# EAGLE design OGX360I-4CH - Main (EAGLE 9.6.2)
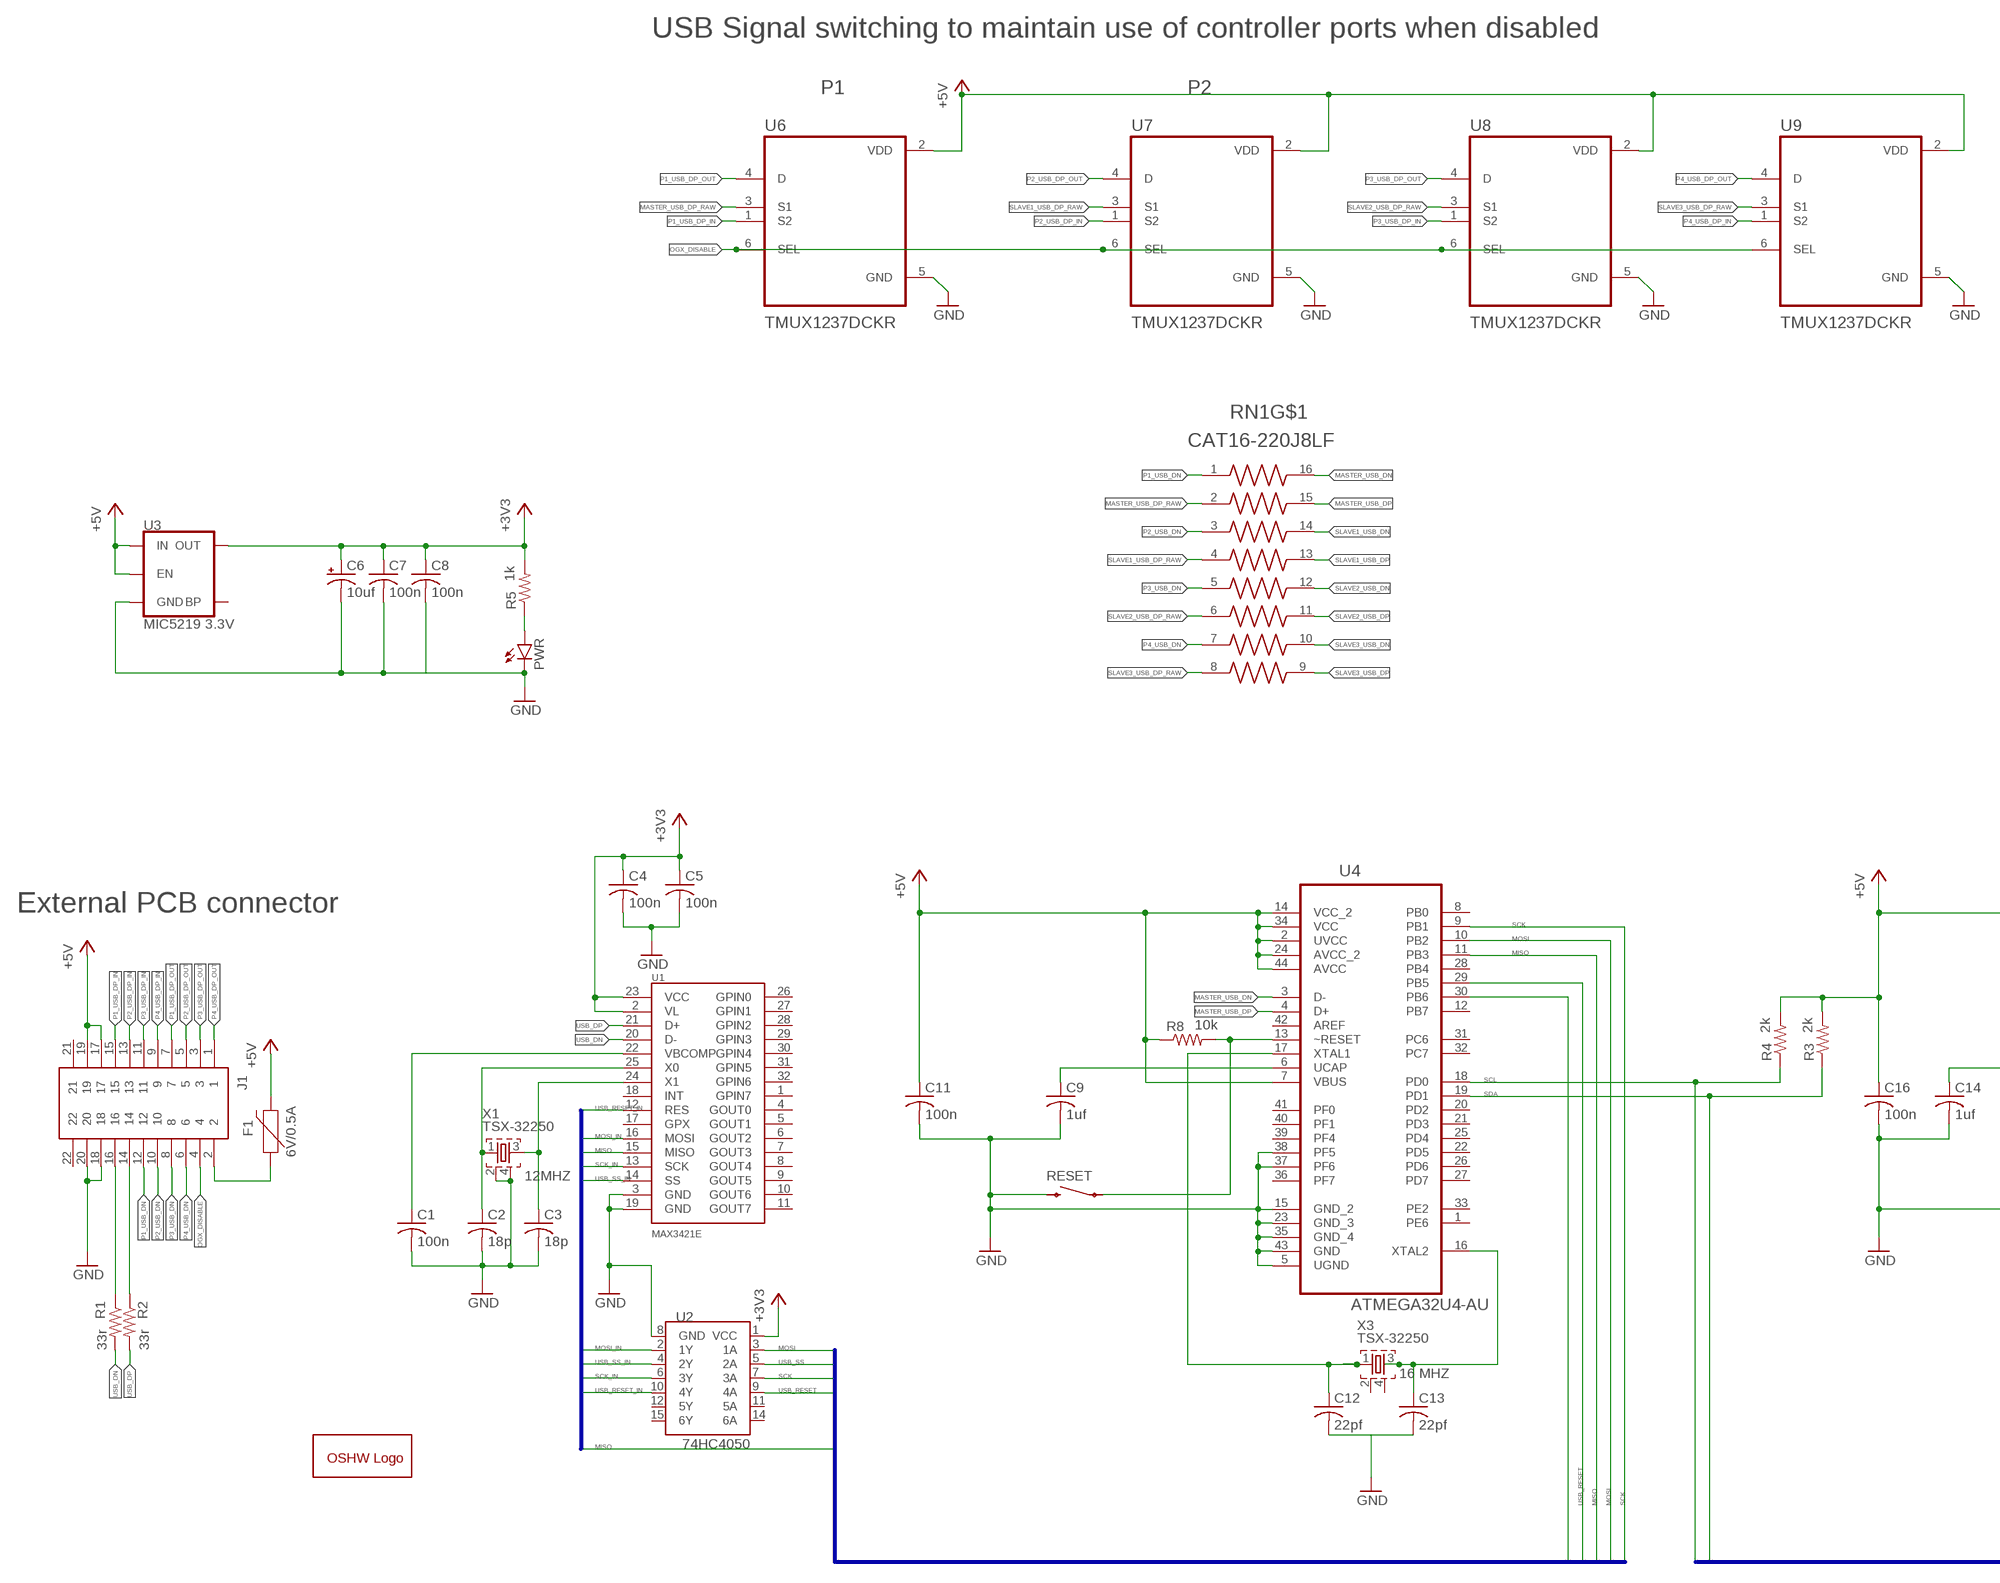
[diagram p0: schematic, sheet 1, part 1 of 2]
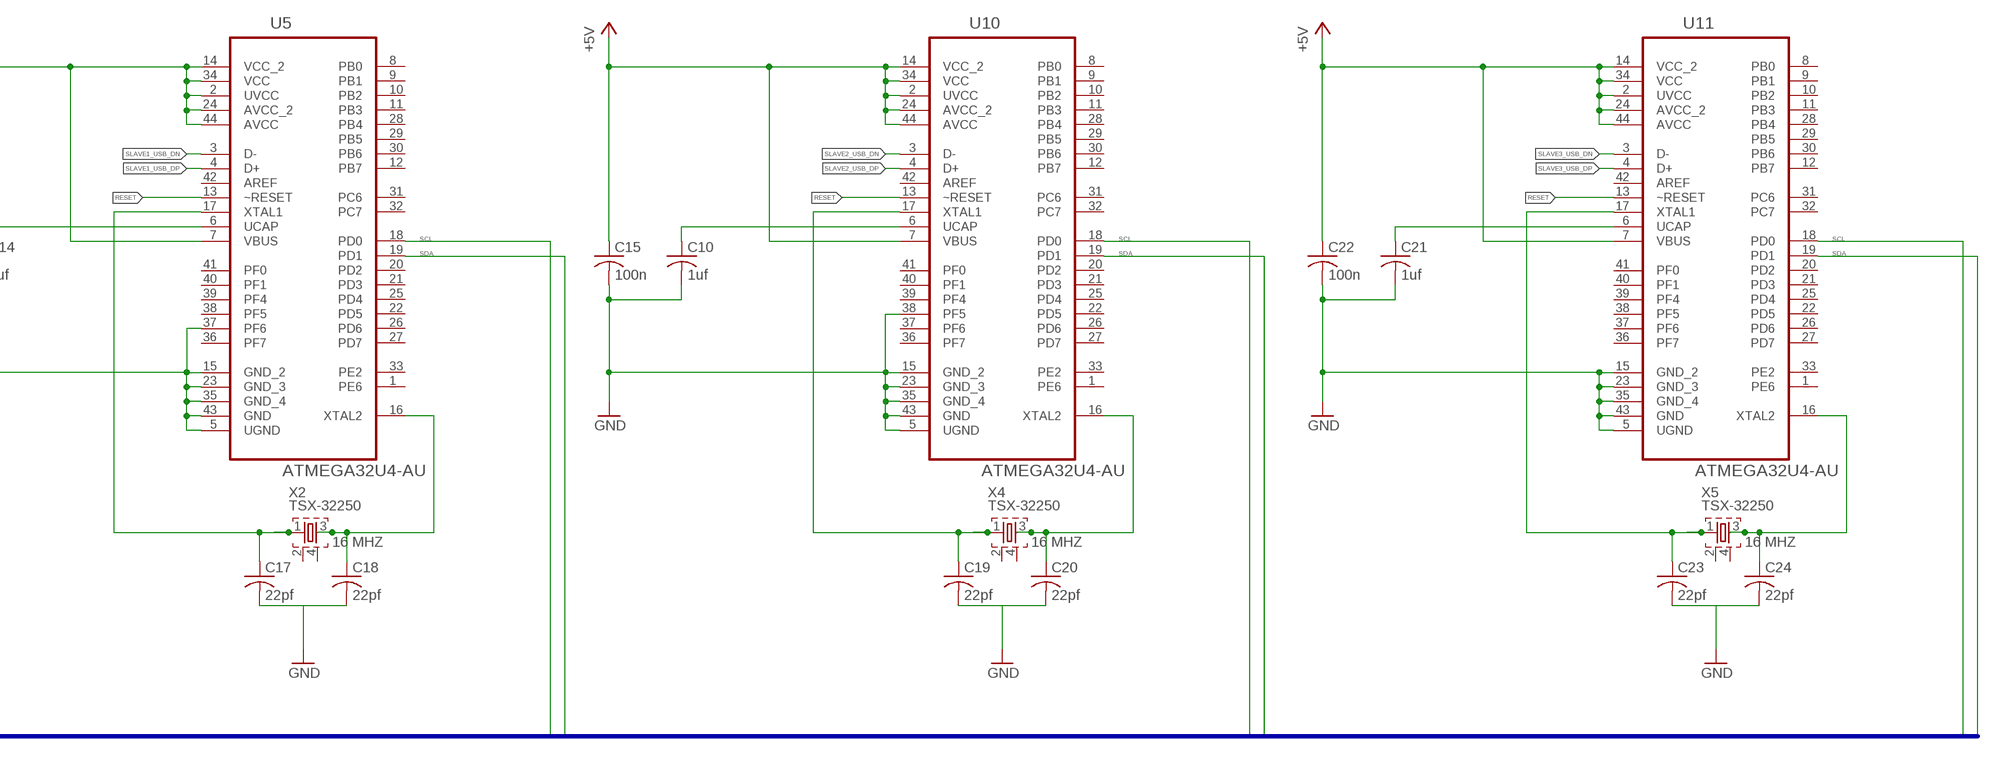
[diagram p1: schematic, sheet 1, part 2 of 2]

## Parts
C1  100n  C-USC0805  [C0805]
C2  18p  C-USC0805  [C0805]
C3  18p  C-USC0805  [C0805]
C4  100n  C-USC0805  [C0805]
C5  100n  C-USC0805  [C0805]
C6  10uf  CPOL-US153CLV-0405  [153CLV-0405]
C7  100n  C-USC0805  [C0805]
C8  100n  C-USC0805  [C0805]
C9  1uf  C-USC0805  [C0805]
C10  1uf  C-USC0805  [C0805]
C11  100n  C-USC0805  [C0805]
C12  22pf  C-USC0805  [C0805]
C13  22pf  C-USC0805  [C0805]
C14  1uf  C-USC0805  [C0805]
C15  100n  C-USC0805  [C0805]
C16  100n  C-USC0805  [C0805]
C17  22pf  C-USC0805  [C0805]
C18  22pf  C-USC0805  [C0805]
C19  22pf  C-USC0805  [C0805]
C20  22pf  C-USC0805  [C0805]
C21  1uf  C-USC0805  [C0805]
C22  100n  C-USC0805  [C0805]
C23  22pf  C-USC0805  [C0805]
C24  22pf  C-USC0805  [C0805]
F1  6V/0.5A  PPTC_HALF-AMP  [1206]
GOLD_ORB_SM1  OSHWLOGOLOGO8MM  [OSHW_8MM]
J1  SM20B-SRDS-G-TF(LF)(SN)  [SM20BSRDSGTFLFSN]
PWR  LEDCHIP-LED0805  [CHIP-LED0805]
R1  33r  R-US_M0805  [M0805]
R2  33r  R-US_M0805  [M0805]
R3  2k  R-US_M0805  [M0805]
R4  2k  R-US_M0805  [M0805]
R5  1k  R-US_M0805  [M0805]
R8  10k  R-US_M0805  [M0805]
RESET  TL3305AF160QG  [TL3305AF160QG]
RN1  CAT16-220J8LF  CAT16-330J8LF  [RESCAV80P640X160X75-16N]
U1  MAX3421E  [TQFP32-5MM]
U2  74HC4050  HEX_CONVERTER  [SO16]
U3  MIC5219 3.3V  V_REG_MIC52193.3V  [SOT23-5]
U4  ATMEGA32U4-AU  [QFP80P1200X1200X120-44N]
U5  ATMEGA32U4-AU  [QFP80P1200X1200X120-44N]
U6  TMUX1237DCKR  [SOT65P210X110-6N]
U7  TMUX1237DCKR  [SOT65P210X110-6N]
U8  TMUX1237DCKR  [SOT65P210X110-6N]
U9  TMUX1237DCKR  [SOT65P210X110-6N]
U10  ATMEGA32U4-AU  [QFP80P1200X1200X120-44N]
U11  ATMEGA32U4-AU  [QFP80P1200X1200X120-44N]
X1  TSX-32250  [TSX-3225]
X2  TSX-32250  [TSX-3225]
X3  TSX-32250  [TSX-3225]
X4  TSX-32250  [TSX-3225]
X5  TSX-32250  [TSX-3225]

## Nets
+3V3: C4.1 C5.1 C6.+ C7.1 C8.1 R5.2 U1.2(VL) U1.23(VCC) U2.1(VCC) U3.5(OUT)
+5V: C11.1 C15.1 C16.1 C22.1 F1.2 J1.17 J1.19 R3.2 R4.2 R8.1 U3.1(IN) U3.3(EN) U4.2(UVCC) U4.7(VBUS) U4.14(VCC_2) U4.24(AVCC_2) U4.34(VCC) U4.44(AVCC) U5.2(UVCC) U5.7(VBUS) U5.14(VCC_2) U5.24(AVCC_2) U5.34(VCC) U5.44(AVCC) U6.2(VDD) U7.2(VDD) U8.2(VDD) U9.2(VDD) U10.2(UVCC) U10.7(VBUS) U10.14(VCC_2) U10.24(AVCC_2) U10.34(VCC) U10.44(AVCC) U11.2(UVCC) U11.7(VBUS) U11.14(VCC_2) U11.24(AVCC_2) U11.34(VCC) U11.44(AVCC)
EXT_USB_DN: J1.16 R1.1
EXT_USB_DP: J1.14 R2.1
FUSED_+5V: F1.1 J1.2
GND: C1.2 C2.2 C3.2 C4.2 C5.2 C6.- C7.2 C8.2 C9.2 C10.2 C11.2 C12.2 C13.2 C14.2 C15.2 C16.2 C17.2 C18.2 C19.2 C20.2 C21.2 C22.2 C23.2 C24.2 J1.18 J1.20 PWR.C RESET.P$1 RESET.P$2 U1.3(GND) U1.19(GND) U2.8(GND) U3.2(GND) U4.5(UGND) U4.15(GND_2) U4.23(GND_3) U4.35(GND_4) U4.37(PF6) U4.38(PF5) U4.43(GND) U5.5(UGND) U5.15(GND_2) U5.23(GND_3) U5.35(GND_4) U5.37(PF6) U5.43(GND) U6.5(GND) U7.5(GND) U8.5(GND) U9.5(GND) U10.5(UGND) U10.15(GND_2) U10.23(GND_3) U10.35(GND_4) U10.38(PF5) U10.43(GND) U11.5(UGND) U11.15(GND_2) U11.23(GND_3) U11.35(GND_4) U11.43(GND) X1.2 X1.4
MASTER_USB_DN: RN1.16(R1-2) U4.3(D-)
MASTER_USB_DP: RN1.15(R2-2) U4.4(D+)
MASTER_USB_DP_RAW: RN1.2(R2-1) U6.3(S1)
MISO: U1.15(MISO) U4.11(PB3)
MOSI: U2.3(1A) U4.10(PB2)
MOSI_IN: U1.16(MOSI) U2.2(1Y)
N$1: C13.1 U4.16(XTAL2) X3.3
N$2: C3.1 U1.24(X1) X1.3
N$3: C10.1 U10.6(UCAP)
N$4: PWR.A R5.1
N$5: C2.1 U1.25(X0) X1.1
N$6: C1.1 U1.22(VBCOMP)
N$8: C20.1 U10.16(XTAL2) X4.3
N$9: C19.1 U10.17(XTAL1) X4.1
N$10: C9.1 U4.6(UCAP)
N$11: C21.1 U11.6(UCAP)
N$12: C24.1 U11.16(XTAL2) X5.3
N$13: C23.1 U11.17(XTAL1) X5.1
N$14: C12.1 U4.17(XTAL1) X3.1
N$15: C14.1 U5.6(UCAP)
N$20: C18.1 U5.16(XTAL2) X2.3
N$21: C17.1 U5.17(XTAL1) X2.1
OGX_DISABLE: J1.4 U6.6(SEL) U7.6(SEL) U8.6(SEL) U9.6(SEL)
P1_USB_DN: J1.12 RN1.1(R1-1)
P1_USB_DP_IN: J1.15 U6.1(S2)
P1_USB_DP_OUT: J1.7 U6.4(D)
P2_USB_DN: J1.10 RN1.3(R3-1)
P2_USB_DP_IN: J1.13 U7.1(S2)
P2_USB_DP_OUT: J1.5 U7.4(D)
P3_USB_DN: J1.8 RN1.5(R5-1)
P3_USB_DP_IN: J1.11 U8.1(S2)
P3_USB_DP_OUT: J1.3 U8.4(D)
P4_USB_DN: J1.6 RN1.7(R7-1)
P4_USB_DP_IN: J1.9 U9.1(S2)
P4_USB_DP_OUT: J1.1 U9.4(D)
RESET: R8.2 RESET.P$3 RESET.P$4 U4.13(~RESET) U5.13(~RESET) U10.13(~RESET) U11.13(~RESET)
SCK: U2.7(3A) U4.9(PB1)
SCK_IN: U1.13(SCK) U2.6(3Y)
SCL: R4.1 U4.18(PD0) U5.18(PD0) U10.18(PD0) U11.18(PD0)
SDA: R3.1 U4.19(PD1) U5.19(PD1) U10.19(PD1) U11.19(PD1)
SLAVE1_USB_DN: RN1.14(R3-2) U5.3(D-)
SLAVE1_USB_DP: RN1.13(R4-2) U5.4(D+)
SLAVE1_USB_DP_RAW: RN1.4(R4-1) U7.3(S1)
SLAVE2_USB_DN: RN1.12(R5-2) U10.3(D-)
SLAVE2_USB_DP: RN1.11(R6-2) U10.4(D+)
SLAVE2_USB_DP_RAW: RN1.6(R6-1) U8.3(S1)
SLAVE3_USB_DN: RN1.10(R7-2) U11.3(D-)
SLAVE3_USB_DP: RN1.9(R8-2) U11.4(D+)
SLAVE3_USB_DP_RAW: RN1.8(R8-1) U9.3(S1)
USB_DN: R1.2 U1.20(D-)
USB_DP: R2.2 U1.21(D+)
USB_RESET: U2.9(4A) U4.29(PB5)
USB_RESET_IN: U1.12(RES) U2.10(4Y)
USB_SS: U2.5(2A) U4.30(PB6)
USB_SS_IN: U1.14(SS) U2.4(2Y)
Unconnected: J1.21 J1.22 U1.1(GPIN7) U1.4(GOUT0) U1.5(GOUT1) U1.6(GOUT2) U1.7(GOUT3) U1.8(GOUT4) U1.9(GOUT5) U1.10(GOUT6) U1.11(GOUT7) U1.17(GPX) U1.18(INT) U1.26(GPIN0) U1.27(GPIN1) U1.28(GPIN2) U1.29(GPIN3) U1.30(GPIN4) U1.31(GPIN5) U1.32(GPIN6) U2.11(5A) U2.12(5Y) U2.14(6A) U2.15(6Y) U3.4(BP) U4.1(PE6) U4.8(PB0) U4.12(PB7) U4.20(PD2) U4.21(PD3) U4.22(PD5) U4.25(PD4) U4.26(PD6) U4.27(PD7) U4.28(PB4) U4.31(PC6) U4.32(PC7) U4.33(PE2) U4.36(PF7) U4.39(PF4) U4.40(PF1) U4.41(PF0) U4.42(AREF) U5.1(PE6) U5.8(PB0) U5.9(PB1) U5.10(PB2) U5.11(PB3) U5.12(PB7) U5.20(PD2) U5.21(PD3) U5.22(PD5) U5.25(PD4) U5.26(PD6) U5.27(PD7) U5.28(PB4) U5.29(PB5) U5.30(PB6) U5.31(PC6) U5.32(PC7) U5.33(PE2) U5.36(PF7) U5.38(PF5) U5.39(PF4) U5.40(PF1) U5.41(PF0) U5.42(AREF) U10.1(PE6) U10.8(PB0) U10.9(PB1) U10.10(PB2) U10.11(PB3) U10.12(PB7) U10.20(PD2) U10.21(PD3) U10.22(PD5) U10.25(PD4) U10.26(PD6) U10.27(PD7) U10.28(PB4) U10.29(PB5) U10.30(PB6) U10.31(PC6) U10.32(PC7) U10.33(PE2) U10.36(PF7) U10.37(PF6) U10.39(PF4) U10.40(PF1) U10.41(PF0) U10.42(AREF) U11.1(PE6) U11.8(PB0) U11.9(PB1) U11.10(PB2) U11.11(PB3) U11.12(PB7) U11.20(PD2) U11.21(PD3) U11.22(PD5) U11.25(PD4) U11.26(PD6) U11.27(PD7) U11.28(PB4) U11.29(PB5) U11.30(PB6) U11.31(PC6) U11.32(PC7) U11.33(PE2) U11.36(PF7) U11.37(PF6) U11.38(PF5) U11.39(PF4) U11.40(PF1) U11.41(PF0) U11.42(AREF) X2.2 X2.4 X3.2 X3.4 X4.2 X4.4 X5.2 X5.4

## Buses
SPI_BUS_3.3V:MISO,MOSI_IN,SCK_IN,USB_RESET_IN,USB_SS_IN
SPI_BUS_5V:MISO,MOSI,SCK,USB_RESET,USB_SS
I2C:SCL,SDA

## Notes on the sheet
- USB Signal switching to maintain use of controller ports when disabled
- P1 | P2
- External PCB connector
- 12MHZ
- 16 MHZ | 16 MHZ | 16 MHZ | 16 MHZ

## Library data of the parts
C1-C5 C7-C24 = rcl:C-US: CAPACITOR, American symbol; SPICEPREFIX: C
C6 = rcl:CPOL-US: POLARIZED CAPACITOR, American symbol; SPICEPREFIX: C
F1 = SparkFun-Fuses:PPTC: Resettable Fuse PPTC Resettable Fuse. Really a sort of resistor with a polymeric positive temperature coefficient whose resistance increases dramatically with an increase in temperature. When heated by the power passing through the resistance rises causing the current to be limited, protecting the circuit. This is achieved by the transition of the polymer from a crystalline to an amorphous state where the conductive carbon separates breaking the conductive pathways found in the cool crystalline structure. When a PPTC cools back down it resumes conducting letting the circuit turn back on. SparkFun Products: SparkFun RedBoard - Programmed with Arduino <https://www.sparkfun.com/products/12757> Pro Micro - 5V/16MHz <https://www.sparkfun.com/products/12640> Arduino Pro 328 - 5V/16MHz <https://www.sparkfun.com/products/10915> MP3 Trigger <https://www.sparkfun.com/products/13720>; PROD_ID: RES-08585
GOLD_ORB_SM1 = oshw:OSHWLOGO: The OSHW logo for PCB layout
J1 = SM20B-SRDS-G-TFLFSN:SM20B-SRDS-G-TF(LF)(SN): JST SHD, 1mm Pitch, 20 Way, Right Angle PCB Header, Surface Mount Source: Datasheet <http://www.jst-mfg.com/product/pdf/eng/eSHD.pdf>; DESCRIPTION: JST SHD, 1mm Pitch, 20 Way, Right Angle PCB Header, Surface Mount; HEIGHT: 5.5mm; MANUFACTURER_NAME: JST (JAPAN SOLDERLESS TERMINALS); MANUFACTURER_PART_NUMBER: SM20B-SRDS-G-TF(LF)(SN)
PWR = led:LED: LED OSRAM: - CHIPLED LG R971, LG N971, LY N971, LG Q971, LY Q971, LO R971, LY R971 LH N974, LH R974 LS Q976, LO Q976, LY Q976 LO Q996 - Hyper CHIPLED LW Q18S LB Q993, LB Q99A, LB R99A - SideLED LS A670, LO A670, LY A670, LG A670, LP A670 LB A673, LV A673, LT A673, LW A673 LH A674 LY A675 LS A676, LA A676, LO A676, LY A676, LW A676 LS A679, LY A679, LG A679 - Hyper Micro SIDELED® LS Y876, LA Y876, LO Y876, LY Y876 LT Y87S - SmartLED LW L88C, LW L88S LB L89C, LB L89S, LG L890 LS L89K, LO L89K, LY L89K LS L896, LA L896, LO L896, LY L896 - TOPLED LS T670, LO T670, LY T670, LG T670, LP T670 LSG T670, LSP T670, LSY T670, LOP T670, LYG T670 LG T671, LOG T671, LSG T671 LB T673, LV T673, LT T673, LW T673 LH T674 LS T676, LA T676, LO T676, LY T676, LB T676, LH T676, LSB T676, LW T676 LB T67C, LV T67C, LT T67C, LS T67K, LO T67K, LY T67K, LW E67C LS E67B, LA E67B, LO E67B, LY E67B, LB E67C, LV E67C, LT E67C LW T67C LS T679, LY T679, LG T679 LS T770, LO T770, LY T770, LG T770, LP T770 LB T773, LV T773, LT T773, LW T773 LH T774 LS E675, LA E675, LY E675, LS T675 LS T776, LA T776, LO T776, LY T776, LB T776 LHGB T686 LT T68C, LB T68C - Hyper Mini TOPLED® LB M676 - Mini TOPLED Santana® LG M470 LS M47K, LO M47K, LY M47K Source: http://www.osram.convergy.de LUXEON: - LUMILED® LXK2-PW12-R00, LXK2-PW12-S00, LXK2-PW14-U00, LXK2-PW14-V00 LXK2-PM12-R00, LXK2-PM12-S00, LXK2-PM14-U00 LXK2-PE12-Q00, LXK2-PE12-R00, LXK2-PE12-S00, LXK2-PE14-T00, LXK2-PE14-U00 LXK2-PB12-K00, LXK2-PB12-L00, LXK2-PB12-M00, LXK2-PB14-N00, LXK2-PB14-P00, LXK2-PB14-Q00 LXK2-PR12-L00, LXK2-PR12-M00, LXK2-PR14-Q00, LXK2-PR14-R00 LXK2-PD12-Q00, LXK2-PD12-R00, LXK2-PD12-S00 LXK2-PH12-R00, LXK2-PH12-S00 LXK2-PL12-P00, LXK2-PL12-Q00, LXK2-PL12-R00 Source: www.luxeon.com KINGBRIGHT: KA-3528ASYC Source: www.kingbright.com
R1-R5 R8 = rcl:R-US_: RESISTOR, American symbol; SPICEPREFIX: R
RESET = TL3305AF160QG:TL3305AF160QG
RN1 = CAT16-330J8LF:CAT16-330J8LF: 33 Ohm ±5% 62.5mW Power Per Element Isolated Resistor Network/Array ±200ppm/°C 2506, Concave, Long Side Terminals Check prices <https://pricing.snapeda.com/parts/CAT16-330J8LF/Bourns/view-part?ref=eda>; AVAILABILITY: Good; DESCRIPTION: 33 Ohm ±5% 62.5mW Power Per Element Isolated Resistor Network/Array ±200ppm/°C 2506, Concave, Long Side Terminals; MF: Bourns; MP: CAT16-330J8LF; PACKAGE: 2506 Bourns; PRICE: None; PURCHASE-URL: https://pricing.snapeda.com/search/part/CAT16-330J8LF/?ref=eda
U1 = MAX3421E:MAX3421E: USB Peripheral/Host Controller with SPI Interface.; AVAILABILITY: Unavailable; DESCRIPTION: USB Controller USB 2.0 SPI Interface 32-TQFN _5x5_; MF: Maxim Integrated; MP: MAX3421E; PACKAGE: TQFP-32 Maxim Integrated; PRICE: None
U2 = 74HC4050:HEX_CONVERTER: 74HC4050 Hex Buffer 74HC4050 Hex Buffer Level Shifter SMD SO016 SparkFun Products CAN-BUS Shield <https://www.sparkfun.com/products/13262> (DEV-13262) SparkFun MP3 Player Shield <https://www.sparkfun.com/products/12660> (DEV-12660) SparkFun microSD Shield <https://www.sparkfun.com/products/12761> (DEV-12761) SparkFun USB Host Shield <https://www.sparkfun.com/products/9947> (DEV-09947); PROD_ID: IC-09604
U3 = MIC5219-3.3YM5-TR:V_REG_MIC5219: V_REG MIC5219 Standard 3.3V and 5V 500mA LDO voltage regulator in SOT-23 layout. Micrel part MIC5219. BP (by-pass) pin is used to lower output noise with 470pF cap, may be left open.; PROD_ID: VREG-09872
U4 U5 U10 U11 = ATMEGA32U4-AU:ATMEGA32U4-AU: 8-bit Microcontroller with ISP Flash and USB Controller; AVAILABILITY: Unavailable; DESCRIPTION: AVR AVR® ATmega Microcontroller IC 8-Bit 16MHz 32KB _16K x 16_ FLASH 44-TQFP _10x10_; MF: Microchip; MP: ATMEGA32U4-AU; PACKAGE: TQFP-44 Microchip; PRICE: None
U6-U9 = TMUX1237DCKR:TMUX1237DCKR: None Check prices <https://pricing.snapeda.com/search/part/TMUX1237DCKR/?ref=eda>; AVAILABILITY: Warning; DESCRIPTION: 3-? low ron, 5-V, 2:1 (SPDT) general purpose switch with no overshoot when switching inputs 6-SC70 -40 to 125; MF: Texas Instruments; MP: TMUX1237DCKR; PACKAGE: SOT-SC70-6 Texas Instruments; PRICE: None; PURCHASE-URL: https://pricing.snapeda.com/search/part/TMUX1237DCKR/?ref=eda
X1-X5 = TSX-3225:TSX-3225: MHz RANGE CRYSTAL UNIT Source: Epson Toyocom; DESCRIPTION: 26MHz ±10ppm Crystal 9pF 40 Ohms 4-SMD, No Lead; DIGI-KEY_PART_NUMBER: SER4180CT-ND; DIGI-KEY_PURCHASE_URL: https://www.digikey.com/product-detail/en/epson/TSX-3225-24.0000MF15X-AC6/SER4180CT-ND/6558821?utm_source=snapeda&utm_medium=aggregator&utm_campaign=symbol; MF: EPSON; MP: TSX-3225; PACKAGE: SMD-4 Epson

## Board
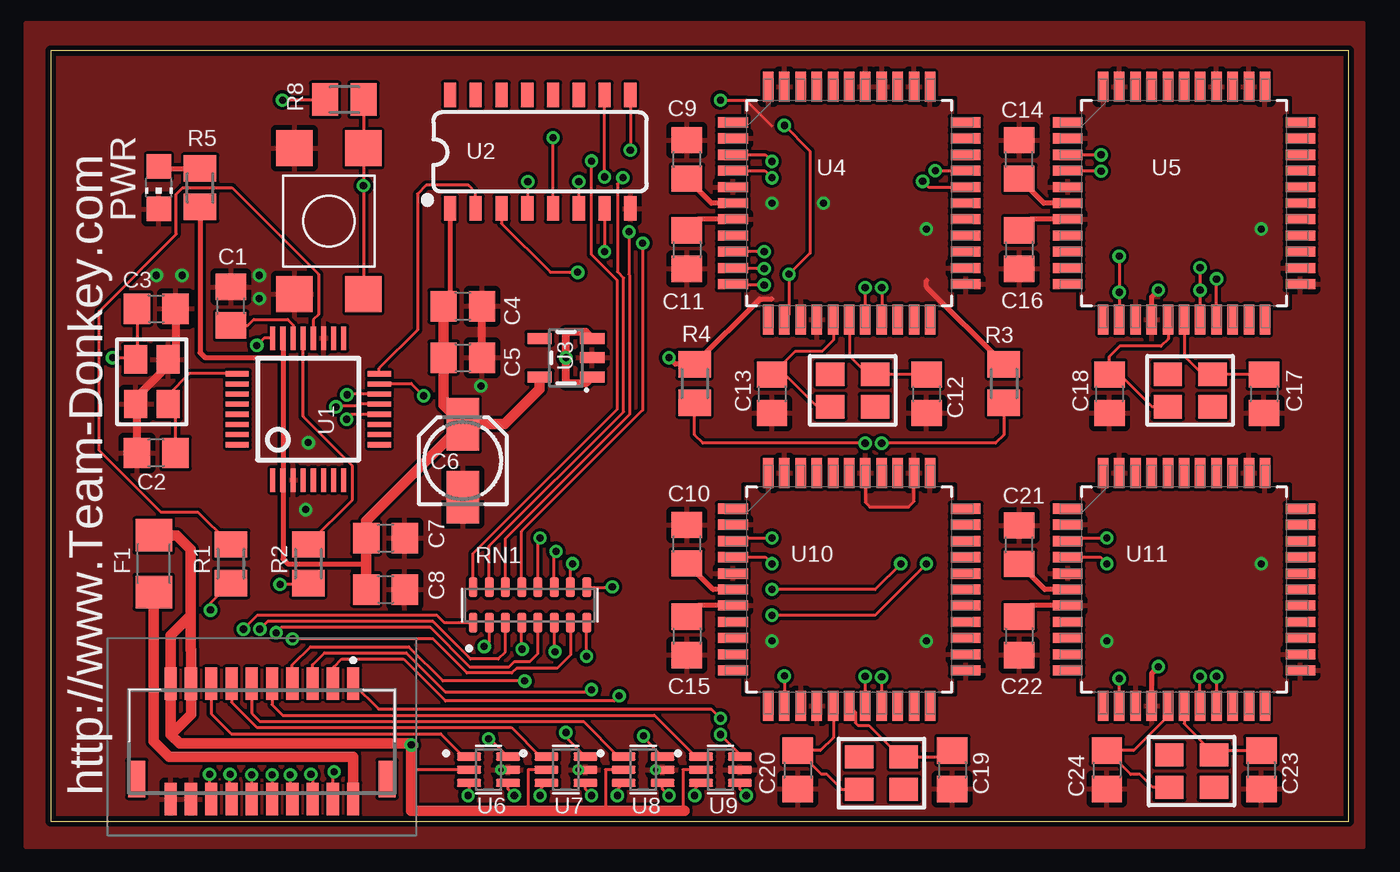
[diagram p2: board, top side]
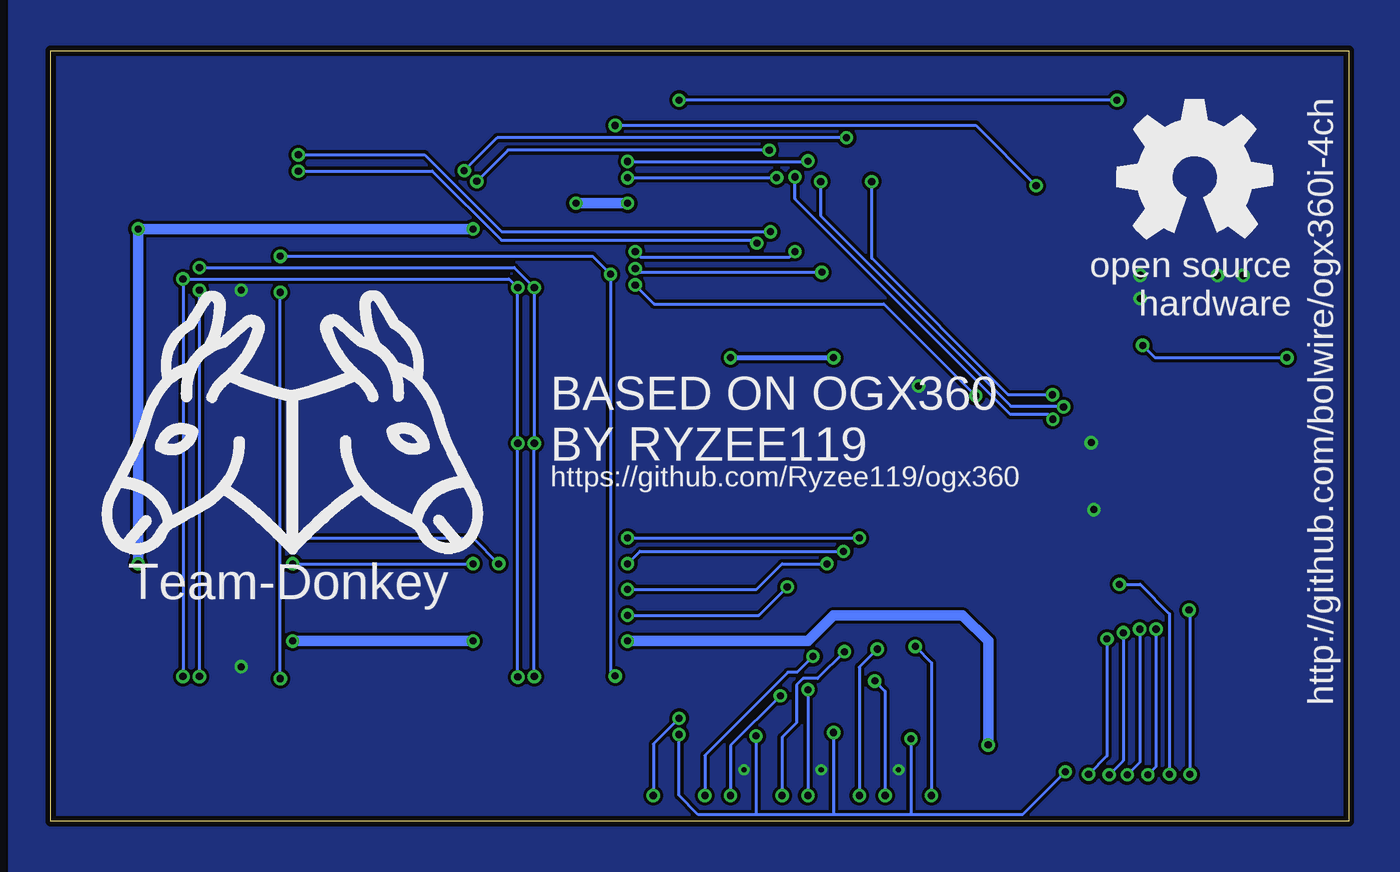
[diagram p3: board, bottom side, seen from below]

Size 64 x 38 mm. Coordinates in mm from the lower left corner, seen from the top.
Outline: 0,0 64,0 64,38 0,38 0,0
Copper layers (1*16): Top 0.035mm / dielectric 0.15mm / Bottom 0.035mm
Design rules "default *": minimum track width 6mil, minimum drill 10mil, track to track 6mil, track to pad 6mil, pad to pad 6mil, via to via 6mil, smd to smd 0mil, copper to edge 10mil, drill to drill 10mil, minimum pad ring 10mil, minimum via ring 6mil, stop-mask expansion 2mil, vias tented up to drill 100mil, thermal gap 10mil

### Footprints (pad centres in the part's own frame; a part is rotated, then mirrored left to right if it is on the bottom)
C0805 = smd 1.3 x 1.5: 1 -0.95,0; 2 0.95,0
153CLV-0405 = smd 2.6 x 1.6: + 1.8,0; - -1.8,0
1206 = smd 1.6 x 1.8: 1 -1.4,0; 2 1.4,0
SM20BSRDSGTFLFSN = smd 0.6 x 1.6: 1 4.5,2.85; 2 4.5,-2.85; 3 3.5,2.85; 4 3.5,-2.85; 5 2.5,2.85; 6 2.5,-2.85; 7 1.5,2.85; 8 1.5,-2.85; 9 0.5,2.85; 10 0.5,-2.85; 11 -0.5,2.85; 12 -0.5,-2.85; 13 -1.5,2.85; 14 -1.5,-2.85; 15 -2.5,2.85; 16 -2.5,-2.85; 17 -3.5,2.85; 18 -3.5,-2.85; 19 -4.5,2.85; 20 -4.5,-2.85 | smd 0.85 x 1.8: 21 -6.175,-1.85; 22 6.175,-1.85
CHIP-LED0805 = smd 1.2 x 1.2: A 0,-1.05; C 0,1.05
M0805 = smd 1.3 x 1.6: 1 -0.95,0; 2 0.95,0
TL3305AF160QG = smd 1.778 x 1.778: P$1 -3.6,-1.7; P$2 3.6,-1.7; P$3 -3.6,1.7 | smd 1.778 x 1.779: P$4 3.6,1.7
RESCAV80P640X160X75-16N = smd 0.97 x 0.43: 1 -0.875,2.8; 2 -0.875,2; 3 -0.875,1.2; 4 -0.875,0.4; 5 -0.875,-0.4; 6 -0.875,-1.2; 7 -0.875,-2; 8 -0.875,-2.8; 9 0.875,-2.8; 10 0.875,-2; 11 0.875,-1.2; 12 0.875,-0.4; 13 0.875,0.4; 14 0.875,1.2; 15 0.875,2; 16 0.875,2.8
TQFP32-5MM = smd 1.143 x 0.254: 1 -3.5,1.75; 2 -3.5,1.25; 3 -3.5,0.75; 4 -3.5,0.25; 5 -3.5,-0.25; 6 -3.5,-0.75; 7 -3.5,-1.25; 8 -3.5,-1.75; 17 3.5,-1.75; 18 3.5,-1.25; 19 3.5,-0.75; 20 3.5,-0.25; 21 3.5,0.25; 22 3.5,0.75; 23 3.5,1.25; 24 3.5,1.75 | smd 0.254 x 1.143: 9 -1.75,-3.5; 10 -1.25,-3.5; 11 -0.75,-3.5; 12 -0.25,-3.5; 13 0.25,-3.5; 14 0.75,-3.5; 15 1.25,-3.5; 16 1.75,-3.5; 25 1.75,3.5; 26 1.25,3.5; 27 0.75,3.5; 28 0.25,3.5; 29 -0.25,3.5; 30 -0.75,3.5; 31 -1.25,3.5; 32 -1.75,3.5
SO16 = smd 0.6 x 1.2: 1 -4.445,-2.8; 2 -3.175,-2.8; 3 -1.905,-2.8; 4 -0.635,-2.8; 5 0.635,-2.8; 6 1.905,-2.8; 7 3.175,-2.8; 8 4.445,-2.8; 9 4.445,2.8; 10 3.175,2.8; 11 1.905,2.8; 12 0.635,2.8; 13 -0.635,2.8; 14 -1.905,2.8; 15 -3.175,2.8; 16 -4.445,2.8
SOT23-5 = smd 0.55 x 1.2: 1 -0.95,-1.3; 2 0,-1.3; 3 0.95,-1.3; 4 0.95,1.3; 5 -0.95,1.3
QFP80P1200X1200X120-44N = smd 1.473 x 0.508: 1 -5.74,3.988; 2 -5.74,3.2; 3 -5.74,2.388; 4 -5.74,1.6; 5 -5.74,0.787; 6 -5.74,0; 7 -5.74,-0.787; 8 -5.74,-1.6; 9 -5.74,-2.388; 10 -5.74,-3.2; 11 -5.74,-3.988; 23 5.74,-3.988; 24 5.74,-3.2; 25 5.74,-2.388; 26 5.74,-1.6; 27 5.74,-0.787; 28 5.74,0; 29 5.74,0.787; 30 5.74,1.6; 31 5.74,2.388; 32 5.74,3.2; 33 5.74,3.988 | smd 0.508 x 1.473: 12 -3.988,-5.74; 13 -3.2,-5.74; 14 -2.388,-5.74; 15 -1.6,-5.74; 16 -0.787,-5.74; 17 0,-5.74; 18 0.787,-5.74; 19 1.6,-5.74; 20 2.388,-5.74; 21 3.2,-5.74; 22 3.988,-5.74; 34 3.988,5.74; 35 3.2,5.74; 36 2.388,5.74; 37 1.6,5.74; 38 0.787,5.74; 39 0,5.74; 40 -0.787,5.74; 41 -1.6,5.74; 42 -2.388,5.74; 43 -3.2,5.74; 44 -3.988,5.74
SOT65P210X110-6N = smd 1.19 x 0.4: 1 -0.96,0.65; 2 -0.96,0; 3 -0.96,-0.65; 4 0.96,-0.65; 5 0.96,0; 6 0.96,0.65
TSX-3225 = smd 1.4 x 1.15: 1 0,-1.6; 2 2.2,-1.6; 3 2.2,0; 4 0,0

### Placement (x,y rotation side)
C1  8.89,25.4 90 top
C2  5.21,18.16 180 top
C3  5.21,25.27 0 top
C4  20.32,25.4 0 top
C5  20.32,22.86 0 top
C6  20.32,17.78 90 top
C7  16.51,13.97 0 top
C8  16.51,11.43 0 top
C9  31.37,32.64 90 top
C10  31.37,13.67 90 top
C11  31.37,28.19 270 top
C12  43.18,21.08 270 top
C13  35.56,21.08 270 top
C14  47.75,32.64 90 top
C15  31.37,9.14 270 top
C16  47.75,28.19 270 top
C17  59.82,21.08 270 top
C18  52.2,21.08 270 top
C19  44.45,2.54 270 top
C20  36.83,2.54 270 top
C21  47.75,13.64 90 top
C22  47.75,9.14 270 top
C23  59.69,2.54 270 top
C24  52.07,2.54 270 top
F1  5.08,12.7 90 top
GOLD_ORB_SM1  7.62,31.75 0 bottom
J1  10.41,3.94 0 top
PWR  5.33,31.24 180 top
R1  8.89,12.7 90 top
R2  12.7,12.7 90 top
R3  46.99,21.59 90 top
R4  31.75,21.59 90 top
R5  7.37,31.24 270 top
R8  14.48,35.59 0 top
RESET  13.72,29.59 270 top
RN1  23.62,10.67 90 top
U1  12.7,20.32 90 top
U2  24.13,33.02 0 top
U3  25.4,22.86 90 top
U4  39.37,30.48 0 top
U5  55.88,30.48 0 top
U6  21.59,2.54 0 top
U7  25.4,2.54 0 top
U8  29.21,2.54 0 top
U9  33.02,2.54 0 top
U10  39.37,11.43 0 top
U11  55.88,11.43 0 top
X1  4.19,20.57 90 top
X2  57.28,20.45 180 top
X3  40.64,20.45 180 top
X4  42.06,1.57 180 top
X5  57.35,1.68 180 top

### Tracks (layer width: path | path; a pad name or v marks a point on that pad's centre or on a via)
+3V3
  Top 0.254: U1.23 11.45,22.86 | 11.45,22.86 U1.2 11.45,12.93 11.68,12.7 15.56,12.7 | U2.1 19.68,25.71 C4.1 | R5.2 7.37,23.11 7.62,22.86 11.45,22.86
  Top 0.508: C8.1 15.56,12.7 C7.1 15.56,14.82 C6.+ | C4.1 C5.1 19.37,20.53 C6.+ | U3.5 24.1,21.31 22.37,19.58 C6.+
+5V  (via drill 0.35)
  Top 0.152: U6.2 17.78,2.54 | U7.2 23.54,2.54 23.54,0.59 23.62,0.51 | U8.2 27.35,2.54 27.35,0.56 27.3,0.51 | U9.2 31.16,2.54 31.16,0.59 31.24,0.51 | R8.1 13.5,35.56 v11.43,35.56 | v33.02,35.56 34.29,35.56 35.56,34.29
  Top 0.254: U10.7 31.92,10.64 C15.1 | U11.7 48.3,10.64 C22.1 | U5.7 48.3,29.69 C16.1 | U4.7 31.92,29.69 C11.1 | R3.2 43.18,26.35 43.18,26.67 | 35.56,25.76 34.97,25.76 R4.2 30.8,22.54 v30.48,22.86
  Top 0.406: U3.1 26.38,21.59 25.4,21.59 v25.4,22.86 25.4,24.13 26.38,24.13 U3.3
  Top 0.508: 6.91,10.16 6.91,8.46 6.91,8.45 J1.17 6.91,5.27 5.91,4.27 | 6.91,10.16 6.91,13.41 6.22,14.1 F1.2 | 6.91,10.16 5.91,9.17 J1.19 5.91,4.27 | 5.91,4.27 6.35,3.83 17.75,3.83 | 17.75,3.83 17.78,3.81 v17.78,3.76 | v17.78,3.76 17.78,2.54 17.78,0.51 23.62,0.51 27.3,0.51 31.24,0.51 | 17.75,3.83 17.75,3.79 v17.78,3.76
  Bottom 0.152: v11.43,35.56 v33.02,35.56
  Bottom 0.254: v30.48,22.86 v25.4,22.86
  Bottom 0.508: v17.78,3.76 17.78,8.89 19.05,10.16 25.4,10.16 26.67,8.89 v35.56,8.89 | v43.18,8.89 v52.07,8.89 | v59.69,12.7 v59.69,29.21 v43.18,29.21 | v35.56,30.48 v38.1,30.48
  pour Top: 34.29,16.51 44.45,16.51 44.45,6.35 34.29,6.35
  pour Top: 50.8,16.51 60.96,16.51 60.96,6.35 50.8,6.35
  pour Top: 50.8,35.56 60.96,35.56 60.96,25.4 50.8,25.4
  pour Top: 34.29,35.56 44.45,35.56 44.45,25.4 34.29,25.4
EXT_USB_DN  (via drill 0.35)
  Top 0.152: v7.83,2.31 7.83,1.17 J1.16 | R1.1 7.87,10.73 v7.87,10.41
  Bottom 0.152: v7.87,10.41 7.83,10.37 v7.83,2.31
EXT_USB_DP  (via drill 0.35)
  Top 0.152: v8.84,2.31 8.83,2.24 8.83,1.17 J1.14 | R2.1 12.63,11.68 v11.3,11.68
  Bottom 0.152: v11.3,11.68 10.29,11.68 8.84,10.24 v8.84,2.31
FUSED_+5V
  Top 0.508: J1.2 14.91,3.17 5.84,3.17 5.08,3.94 F1.1
GND  (via drill 0.25, 0.35)
  Top 0.152: U10.38 40.16,15.72 40.39,15.49 42.29,15.49 42.57,15.77 U10.35
  Top 0.254: U11.15 54.28,7.29 v54.61,7.62 | U5.15 54.28,25.86 v54.61,26.19
  Top 0.406: C2.2 4.26,20.51 X1.4 4.19,20.88 5.79,22.48 X1.2 6.16,23.14 C3.2 | C5.2 C4.2
  other vias: 10.29,26.92 10.29,25.78 6.48,26.92 5.21,26.92 12.7,18.67 12.57,15.37 21.21,21.46 22.2,2.54 26.01,2.54 29.82,2.54
  pour Bottom: -2.54,40.64 66.04,40.64 66.04,-2.54 -2.54,-2.54
  pour Top (rank 2): -1.27,39.37 -1.27,-1.27 64.77,-1.27 64.77,39.37
MASTER_USB_DN  (via drill 0.35)
  Top 0.152: U4.3 35.23,32.87 v35.56,32.54 | v26.67,32.56 26.67,27.94 27.94,26.67 27.94,20.32 20.82,13.2 RN1.16
  Bottom 0.152: v35.56,32.54 26.69,32.54 v26.67,32.56
MASTER_USB_DP  (via drill 0.35)
  Top 0.152: U4.4 35.21,32.08 v35.56,31.73 | v28.21,31.74 28.21,31.68 27.95,31.42 27.95,27.1 28.25,26.8 28.25,20.19 21.62,13.57 RN1.15
  Bottom 0.152: v35.56,31.73 v28.21,31.73 v28.21,31.74
MASTER_USB_DP_RAW  (via drill 0.35)
  Top 0.152: U6.3 20.63,1.33 v20.57,1.27 | RN1.2 21.62,8.87 v21.37,8.62
  Bottom 0.152: v21.37,8.62 20.57,7.82 v20.57,1.27
MISO  (via drill 0.35)
  Top 0.152: U1.15 16.22,21.59 17.78,21.59 v18.39,20.98 | v35.18,26.45 33.67,26.45 U4.11
  Bottom 0.152: v18.39,20.98 22.92,25.52 34.25,25.52 v35.18,26.45
MOSI  (via drill 0.35)
  Top 0.152: U2.3 22.23,29.48 24.63,27.08 v25.98,27.08 | v35.18,27.25 33.66,27.25 U4.10
  Bottom 0.152: v35.18,27.25 35,27.08 v25.98,27.08
MOSI_IN
  Top 0.152: U1.16 16.2,22.35 18.09,24.23 18.09,30.94 18.52,31.37 20.59,31.37 20.95,31.01 U2.2
N$1
  Top 0.152: U4.16 38.58,23.72 38.03,23.18 36.7,23.18 C13.1 36.2,22.03 37.78,20.45 X3.3
N$2  (via drill 0.35)
  Top 0.152: C3.1 4.26,22.84 X1.3 4.11,22.86 v3.05,22.86 | U1.24 10.51,23.82 v10.16,23.47
  Bottom 0.152: v10.16,23.47 9.55,22.86 v3.05,22.86
N$3
  Top 0.254: U10.6 32.65,11.43 C10.1
N$4
  Top 0.254: PWR.A 5.43,32.19 R5.1
N$5
  Top 0.152: C2.1 6.16,20.21 X1.1 5.79,21.03 6.83,22.07 U1.25
N$6
  Top 0.152: C1.1 9.72,24.45 10.01,24.75 11.68,24.75 11.95,24.48 U1.22
N$8
  Top 0.152: U10.16 38.58,4.12 37.95,3.49 C20.1 37.98,2.34 38.24,2.34 39,1.57 X4.3
N$9
  Top 0.152: U10.17 39.67,5.38 39.67,4.86 39.81,4.72 40.34,4.72 41.88,3.17 X4.1 44.13,3.17 C19.1
N$10
  Top 0.254: U4.6 32.58,30.48 C9.1
N$11
  Top 0.254: U11.6 49.01,11.43 C21.1
N$12
  Top 0.152: U11.16 55.09,5.19 53.39,3.49 C24.1 53.25,2.31 53.7,2.31 54.34,1.68 X5.3
N$13
  Top 0.152: U11.17 55.88,4.81 57.35,3.33 X5.1 57.57,3.49 C23.1
N$14
  Top 0.152: C12.1 43.16,22.05 X3.1 40.26,22.05 39.37,22.94 U4.17
N$15
  Top 0.254: U5.6 48.96,30.48 C14.1
N$20
  Top 0.152: X2.3 54.29,20.45 52.7,22.03 C18.1 52.2,22.92 52.7,23.43 54.74,23.43 55.09,23.79 U5.16
N$21
  Top 0.152: C17.1 59.8,22.05 X2.1 56.77,22.05 55.88,22.94 U5.17
OGX_DISABLE  (via drill 0.35)
  Top 0.152: J1.4 13.91,2.38 v13.97,2.44 | v33.02,4.27 33.98,3.31 U9.6 | U8.6 29.22,4.14 v29.22,4.21 | U7.6 25.4,4.15 v25.4,4.37 | U6.6 21.67,4.07 v21.59,4.07
  Bottom 0.152: v13.97,2.44 16.08,0.33 21.59,0.33 | v33.02,4.27 33.02,1.27 32.08,0.33 29.21,0.33 | 21.59,0.33 25.4,0.33 | 25.4,0.33 29.21,0.33 | v29.22,4.21 29.22,0.34 29.21,0.33 | v25.4,4.37 25.4,0.33 | v21.59,4.07 21.59,0.33
P1_USB_DN  (via drill 0.35)
  Top 0.152: v9.5,9.48 10.18,10.16 19.05,10.16 19.42,9.79 RN1.1 | v9.91,2.29 9.91,2.28 J1.12
  Bottom 0.152: v9.5,9.48 9.5,2.69 v9.91,2.29
P1_USB_DP_IN
  Top 0.152: J1.15 7.91,5.29 8.89,4.32 19.22,4.32 20.35,3.19 U6.1
P1_USB_DP_OUT  (via drill 0.35)
  Top 0.152: J1.7 11.91,7.72 12.81,8.61 17.65,8.61 19.35,6.92 v23.37,6.92 | v22.86,1.27 22.55,1.58 U6.4
  Bottom 0.152: v23.37,6.92 22.86,6.41 v22.86,1.27
P2_USB_DN  (via drill 0.35)
  Top 0.152: v10.31,9.48 10.69,9.86 18.85,9.86 20.7,8 22.06,8 22.42,8.37 RN1.3 | v10.92,2.29 10.92,1.09 J1.10
  Bottom 0.152: v10.31,9.48 10.31,2.9 v10.92,2.29
P2_USB_DP_IN
  Top 0.152: J1.13 8.91,5.87 10.16,4.62 22.71,4.62 24.15,3.19 U7.1
P2_USB_DP_OUT  (via drill 0.35)
  Top 0.152: J1.5 12.91,7.72 13.5,8.31 17.52,8.31 19.47,6.36 26.54,6.36 v26.67,6.49 | v26.67,1.27 26.36,1.58 U7.4
  Bottom 0.152: v26.67,6.49 v26.67,1.27
P3_USB_DN  (via drill 0.35)
  Top 0.152: v11.12,9.3 11.37,9.55 18.72,9.55 20.65,7.62 22.61,7.62 22.86,7.87 23.62,7.87 24.02,8.27 RN1.5 | v11.81,2.29 11.81,1.19 J1.8
  Bottom 0.152: v11.12,9.3 11.12,2.98 v11.81,2.29
P3_USB_DP_IN
  Top 0.152: J1.11 9.91,5.33 10.31,4.93 26.26,4.93 28,3.19 U8.1
P3_USB_DP_OUT  (via drill 0.35)
  Top 0.152: J1.3 13.97,6.84 13.97,7.62 14.35,8 17.4,8 19.47,5.93 27.77,5.93 v28.03,6.18 | v30.48,1.27 30.17,1.58 U8.4
  Bottom 0.152: v28.03,6.18 30.48,3.73 v30.48,1.27
P4_USB_DN  (via drill 0.35)
  Top 0.152: v11.92,8.99 18.84,8.99 20.52,7.32 22.73,7.32 22.97,7.55 24.97,7.55 25.62,8.2 RN1.7 | v12.83,2.31 12.91,2.23 J1.6
  Bottom 0.152: v11.92,8.99 11.92,3.22 v12.83,2.31
P4_USB_DP_IN
  Top 0.152: J1.9 10.91,5.75 11.43,5.23 29.76,5.23 31.81,3.19 U9.1
P4_USB_DP_OUT  (via drill 0.35)
  Top 0.152: J1.1 16.16,5.54 32.56,5.54 v33.02,5.08 | v34.29,1.27 33.98,1.58 U9.4
  Bottom 0.152: v33.02,5.08 34.29,3.81 v34.29,1.27
RESET  (via drill 0.35)
  Top 0.152: U4.13 36.4,24.97 v36.4,26.98 37.44,28.02 37.44,33.05 v36.17,34.31 | v52.68,27.86 v52.68,26.09 U5.13 | U11.13 v52.68,7.04 | v36.17,7.16 U10.13 | R8.2 15.42,35.57 RESET.P$3 v15.42,31.34 RESET.P$4
  Bottom 0.152: v52.68,27.86 37.29,27.86 v36.4,26.98 36.4,7.39 v36.17,7.16 | v52.68,7.04 v52.68,26.09 | v36.17,34.31 18.39,34.31 v15.42,31.34
SCK  (via drill 0.35)
  Top 0.152: U2.7 v27.3,28.09 | v35.18,28.09 U4.9
  Bottom 0.152: v27.3,28.09 27.58,27.81 34.9,27.81 v35.18,28.09
SCK_IN  (via drill 0.35)
  Top 0.152: U1.13 15.23,20.57 15.14,20.48 14.1,20.48 v14.06,20.43 | v26.04,31.55 U2.6
  Bottom 0.152: v14.06,20.43 14.1,20.48 16.66,20.48 26.04,29.84 v26.04,31.55
SCL  (via drill 0.35)
  Top 0.152: U10.18 v40.16,7.14 | v40.16,18.64 32.16,18.64 31.75,19.05 R4.1 | U4.18 v40.16,26.31 | U11.18 v56.67,7.14 | U5.18 v56.67,26.19 v56.67,27.3
  Bottom 0.152: v40.16,7.14 v40.16,18.64 v40.16,26.31 41.15,27.3 v56.66,27.3 v56.67,27.3 | v56.67,7.14 v56.67,26.19
SDA  (via drill 0.35)
  Top 0.152: U10.19 v40.97,7.11 | v40.97,26.31 U4.19 | R3.1 46.99,19.05 46.58,18.64 v40.97,18.64 | U5.19 v57.48,26.75 | v57.48,7.14 U11.19
  Bottom 0.152: v40.97,7.11 v40.97,18.64 v40.97,26.31 41.4,26.75 v57.48,26.75 v57.48,7.14
SLAVE1_USB_DN  (via drill 0.35)
  Top 0.152: U5.3 v51.79,32.87 | v28.51,29.07 28.51,26.96 28.55,26.92 28.55,20.07 22.42,13.94 RN1.14
  Bottom 0.152: v51.79,32.87 45.57,32.87 41.77,29.07 v28.51,29.07
SLAVE1_USB_DP  (via drill 0.35)
  Top 0.152: U5.4 51.77,32.08 v51.79,32.06 | v29.18,28.51 29.18,20.27 23.22,14.31 RN1.13
  Bottom 0.152: v51.79,32.06 45.19,32.06 41.78,28.65 29.31,28.65 29.18,28.52 v29.18,28.51
SLAVE1_USB_DP_RAW  (via drill 0.35)
  Top 0.152: v24.13,1.27 24.13,1.58 U7.3 | RN1.4 23.22,8.52 v23.25,8.49
  Bottom 0.152: v23.25,8.49 24.13,7.61 v24.13,1.27
SLAVE2_USB_DN  (via drill 0.35)
  Top 0.152: U10.3 33.78,13.97 v35.56,13.97 | RN1.12 24.02,13.86 v24.13,13.97
  Bottom 0.152: v35.56,13.97 v24.13,13.97
SLAVE2_USB_DP  (via drill 0.35)
  Top 0.152: U10.4 35.23,13.03 v35.56,12.7 | RN1.11 24.82,13.22 v24.91,13.31
  Bottom 0.152: v35.56,12.7 34.95,13.31 v24.91,13.31
SLAVE2_USB_DP_RAW  (via drill 0.35)
  Top 0.152: v27.94,1.27 27.94,1.58 U8.3 | RN1.6 24.82,8.41 v24.87,8.36
  Bottom 0.152: v27.94,1.27 27.94,4.15 27.23,4.86 27.23,6.72 26.9,7.04 26.19,7.04 v24.87,8.36
SLAVE3_USB_DN  (via drill 0.35)
  Top 0.152: U11.3 50.29,13.97 v52.07,13.97 | v41.91,12.7 40.64,11.43 v35.56,11.43 | RN1.10 25.62,12.6 v25.72,12.7
  Bottom 0.152: v52.07,13.97 43.18,13.97 v41.91,12.7 | v35.56,11.43 29.21,11.43 27.94,12.7 v25.72,12.7
SLAVE3_USB_DP  (via drill 0.35)
  Top 0.152: U11.4 51.74,13.03 v52.07,12.7 | v43.18,12.7 40.64,10.16 v35.56,10.16 | RN1.9 27.67,11.54 v27.69,11.56
  Bottom 0.152: v52.07,12.7 v43.18,12.7 | v35.56,10.16 29.08,10.16 v27.69,11.56
SLAVE3_USB_DP_RAW  (via drill 0.35)
  Top 0.152: v31.75,1.27 31.75,1.58 U9.3 | v26.42,8.13 RN1.8
  Bottom 0.152: v26.42,8.13 27.2,7.35 27.65,7.35 31.75,3.25 v31.75,1.27
USB_DN
  Top 0.152: U1.20 12.95,24.73 13.21,24.99 13.21,26.98 8.94,31.24 6.5,31.24 6.2,30.94 6.2,28.96 2.39,25.15 2.39,18.29 5.44,15.24 7.26,15.24 8.79,13.72 R1.2
USB_DP
  Top 0.152: U1.21 12.45,23.77 12.45,19.96 14.88,17.53 14.88,15.85 12.75,13.72 R2.2
USB_RESET  (via drill 0.35)
  Top 0.152: U2.9 v28.57,33.1 | v42.99,31.56 43.28,31.27 U4.29
  Bottom 0.152: v28.57,33.1 41.45,33.1 v42.99,31.56
USB_RESET_IN  (via drill 0.35)
  Top 0.152: U1.12 14.84,20.07 v14.59,19.82 | v27.3,31.77 U2.10
  Bottom 0.152: v14.59,19.82 14.83,20.07 16.69,20.07 27.3,30.68 v27.3,31.77
USB_SS  (via drill 0.35)
  Top 0.152: U2.5 v24.77,33.71 | v43.61,32.08 U4.30
  Bottom 0.152: v43.61,32.08 41.99,33.71 v24.77,33.71
USB_SS_IN  (via drill 0.35)
  Top 0.152: U1.14 14.64,21.07 v14.61,21.03 | v23.52,31.55 23.52,30.25 U2.4
  Bottom 0.152: v14.61,21.03 16.79,21.03 23.52,27.76 v23.52,31.55

### Text on the board
tPlace: http://www.Team-Donkey.com
bPlace: http://github.com/bolwire/ogx360i-4ch | BASED ON OGX360 / BY RYZEE119 | https://github.com/Ryzee119/ogx360 | Team-Donkey
bStop: OGX360I-4CH